# EAGLE design H-Bridge V.2A (EAGLE 7.2.0)
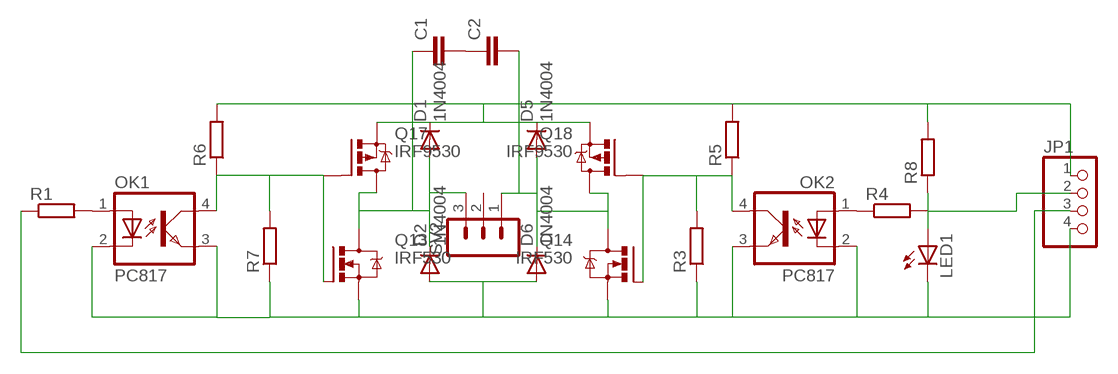
[diagram p0: schematic, sheet 1]

## Parts
C1  C-EU025-025X050  [C025-025X050]
C2  C-EU025-025X050  [C025-025X050]
D1  1N4004  [DO41-10]
D2  1N4004  [DO41-10]
D5  1N4004  [DO41-10]
D6  1N4004  [DO41-10]
JP1  PINHD-1X4  [1X04]
LED1  LED3MM  [LED3MM]
OK1  PC817  [DIL04]
OK2  PC817  [DIL04]
Q13  IRF530  [TO220BV]
Q14  IRF530  [TO220BV]
Q17  IRF9530  [TO220BV]
Q18  IRF9530  [TO220BV]
R1  R-EU_0207/10  [0207/10]
R3  R-EU_0204/7  [0204/7]
R4  R-EU_0207/10  [0207/10]
R5  R-EU_0207/10  [0207/10]
R6  R-EU_0207/10  [0207/10]
R7  R-EU_0204/7  [0204/7]
R8  R-EU_0207/10  [0207/10]
SV2  MA03-1  [MA03-1]

## Nets
+12V: D1.C D5.C JP1.1 Q17.S Q18.S R5.2 R6.2 R8.2
GND: D2.A D6.A JP1.4 LED1.K(C) OK1.2(C) OK1.3(EMIT) OK2.2(C) OK2.3(EMIT) Q13.S Q14.S R3.1 R7.1
N$1: OK2.1(A) R4.1
N$2: OK1.1(A) R1.2
N$3: C1.2 C2.1
N$7: C2.2 D5.A D6.C Q14.D Q18.D SV2.1
N$8: C1.1 D1.A D2.C Q13.D Q17.D SV2.3
N$9: LED1.A R8.1
N$12: OK2.4(COL) Q14.G Q18.G R3.2 R5.1
N$18: OK1.4(COL) Q13.G Q17.G R6.1 R7.2
PWM1: JP1.2 R4.2
PWM2: JP1.3 R1.1
Unconnected: SV2.2

## Library data of the parts
C1 C2 = rcl:C-EU: CAPACITOR, European symbol
D1 D2 D5 D6 = diode:1N4004: DIODE general purpose rectifier, 1 A
JP1 = pinhead:PINHD-1X4: PIN HEADER
LED1 = led:LED: LED OSRAM: - CHIPLED LG R971, LG N971, LY N971, LG Q971, LY Q971, LO R971, LY R971 LH N974, LH R974 LS Q976, LO Q976, LY Q976 LO Q996 - Hyper CHIPLED LW Q18S LB Q993, LB Q99A, LB R99A - SideLED LS A670, LO A670, LY A670, LG A670, LP A670 LB A673, LV A673, LT A673, LW A673 LH A674 LY A675 LS A676, LA A676, LO A676, LY A676, LW A676 LS A679, LY A679, LG A679 - Hyper Micro SIDELED® LS Y876, LA Y876, LO Y876, LY Y876 LT Y87S - SmartLED LW L88C, LW L88S LB L89C, LB L89S, LG L890 LS L89K, LO L89K, LY L89K LS L896, LA L896, LO L896, LY L896 - TOPLED LS T670, LO T670, LY T670, LG T670, LP T670 LSG T670, LSP T670, LSY T670, LOP T670, LYG T670 LG T671, LOG T671, LSG T671 LB T673, LV T673, LT T673, LW T673 LH T674 LS T676, LA T676, LO T676, LY T676, LB T676, LH T676, LSB T676, LW T676 LB T67C, LV T67C, LT T67C, LS T67K, LO T67K, LY T67K, LW E67C LS E67B, LA E67B, LO E67B, LY E67B, LB E67C, LV E67C, LT E67C LW T67C LS T679, LY T679, LG T679 LS T770, LO T770, LY T770, LG T770, LP T770 LB T773, LV T773, LT T773, LW T773 LH T774 LS E675, LA E675, LY E675, LS T675 LS T776, LA T776, LO T776, LY T776, LB T776 LHGB T686 LT T68C, LB T68C - Hyper Mini TOPLED® LB M676 - Mini TOPLED Santana® LG M470 LS M47K, LO M47K, LY M47K Source: http://www.osram.convergy.de LUXEON: - LUMILED® LXK2-PW12-R00, LXK2-PW12-S00, LXK2-PW14-U00, LXK2-PW14-V00 LXK2-PM12-R00, LXK2-PM12-S00, LXK2-PM14-U00 LXK2-PE12-Q00, LXK2-PE12-R00, LXK2-PE12-S00, LXK2-PE14-T00, LXK2-PE14-U00 LXK2-PB12-K00, LXK2-PB12-L00, LXK2-PB12-M00, LXK2-PB14-N00, LXK2-PB14-P00, LXK2-PB14-Q00 LXK2-PR12-L00, LXK2-PR12-M00, LXK2-PR14-Q00, LXK2-PR14-R00 LXK2-PD12-Q00, LXK2-PD12-R00, LXK2-PD12-S00 LXK2-PH12-R00, LXK2-PH12-S00 LXK2-PL12-P00, LXK2-PL12-Q00, LXK2-PL12-R00 Source: www.luxeon.com KINGBRIGHT: KA-3528ASYC Source: www.kingbright.com
OK1 OK2 = optocoupler:PC817: SHARP OPTO COUPLER; MPN: PC817X4J000F; OC_FARNELL: 9707727; OC_NEWARK: 97K7059
Q13 Q14 = transistor-power:IRF530: HEXFET Power MOSFET
Q17 Q18 = transistor-power:IRF9530: P-CHANNEL HEXFET POWER-MOS-FET Source: http://www.irf.com/product-info/datasheets/data/irf9530.pdf
R1 R3-R8 = resistor:R-EU_: RESISTOR, European symbol
SV2 = con-lstb:MA03-1: PIN HEADER

## Board
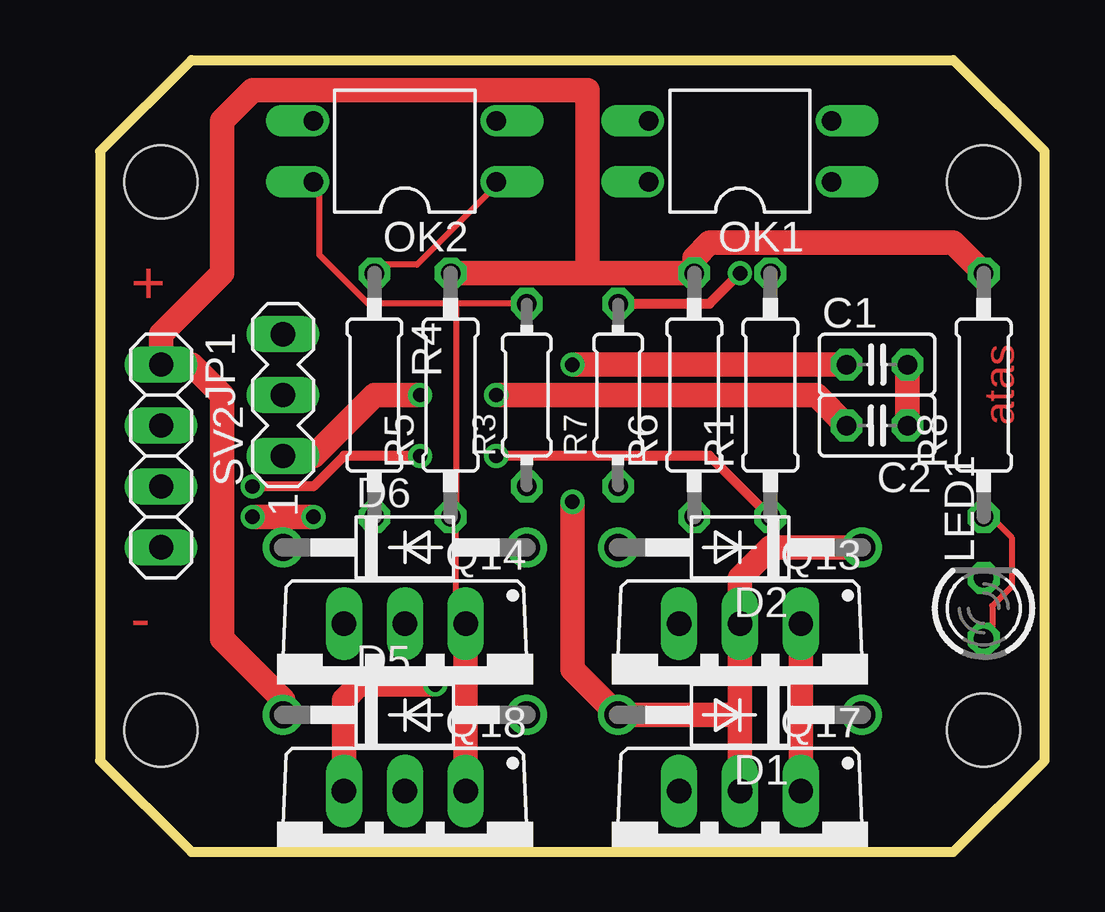
[diagram p1: board, top side]
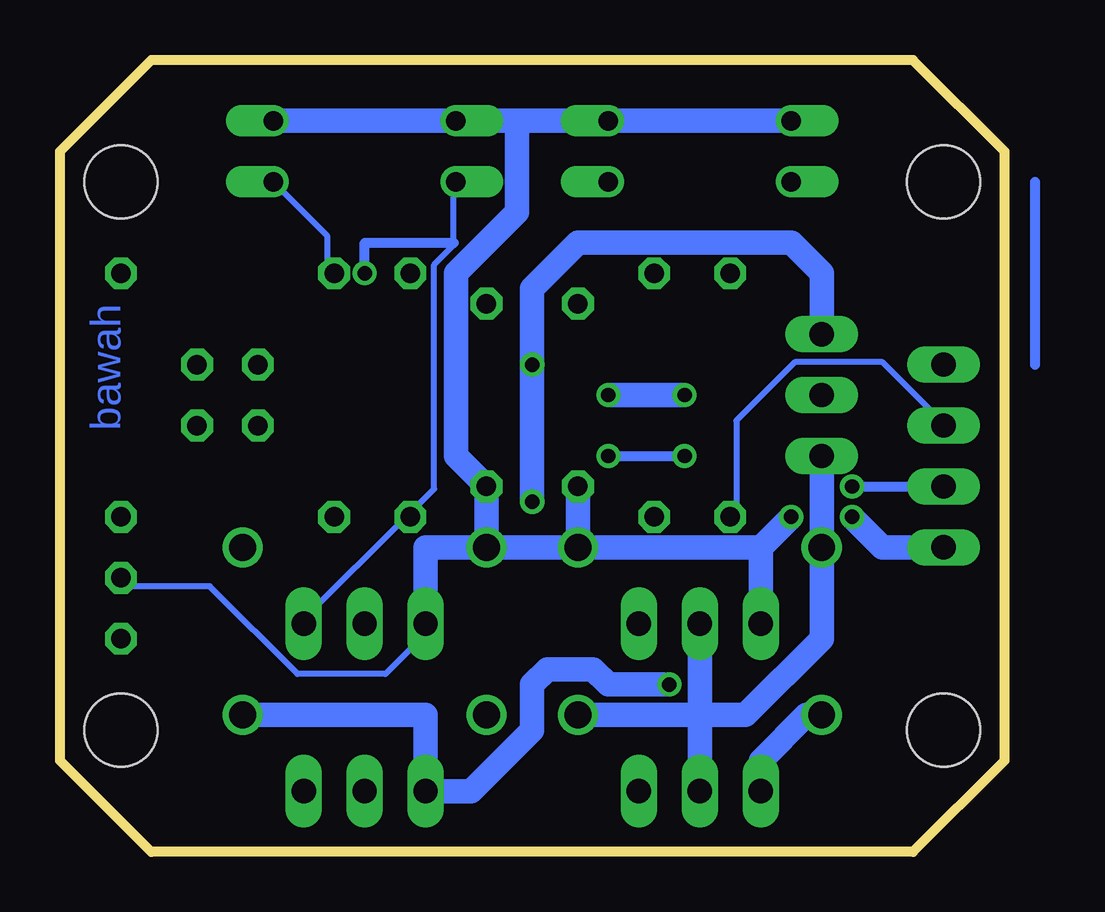
[diagram p2: board, bottom side, seen from below]

Size 39.37 x 33.02 mm. Coordinates in mm from the lower left corner, seen from the top.
Outline: 0,29.21 0,3.81 3.81,0 35.56,0 39.37,3.81 39.37,29.21 35.56,33.02 3.81,33.02 0,29.21
Copper layers (1*16): Top 0.035mm / dielectric 1.5mm / Bottom 0.035mm
Design rules "default": minimum track width 10mil, minimum drill 24mil, track to track 8mil, track to pad 8mil, pad to pad 8mil, via to via 8mil, smd to smd 8mil, copper to edge 40mil, drill to drill 8mil, minimum pad ring 10mil, minimum via ring 8mil, stop-mask expansion 4mil, vias tented up to drill 0mil, thermal gap 10mil
Holes 3.05 mm at 36.83,5.08 36.83,27.94 2.54,27.94 2.54,5.08

### Footprints (pad centres in the part's own frame; a part is rotated, then mirrored left to right if it is on the bottom)
C025-025X050 = drill 0.813 octagon: 1 -1.27,0; 2 1.27,0
DO41-10 = drill 1.118: A 5.08,0; C -5.08,0
1X04 = drill 1.016 long: 1 -3.81,0; 2 -1.27,0; 3 1.27,0; 4 3.81,0
LED3MM = drill 0.813 octagon: A -1.27,0; K 1.27,0
DIL04 = drill 0.813 offset: 1 -1.27,-3.81; 2 1.27,-3.81; 3 1.27,3.81; 4 -1.27,3.81
TO220BV = drill 1.016 long: D 0,-2.54; G -2.54,-2.54; S 2.54,-2.54
0207/10 = drill 0.813 octagon: 1 -5.08,0; 2 5.08,0
0204/7 = drill 0.813 octagon: 1 -3.81,0; 2 3.81,0
MA03-1 = drill 1.016 long: 1 -2.54,0; 2 0,0; 3 2.54,0

### Placement (x,y rotation side)
C1  32.39,20.32 0 top
C2  32.39,17.78 180 top
D1  26.67,5.72 180 top
D2  26.67,12.7 180 top
D5  12.7,5.72 0 top
D6  12.7,12.7 0 top
JP1  2.54,16.51 270 top
LED1  36.83,10.16 90 top
OK1  26.67,29.21 90 top
OK2  12.7,29.21 90 top
Q13  26.67,6.98 180 top
Q14  12.7,6.98 180 top
Q17  26.67,0 180 top
Q18  12.7,0 180 top
R1  27.94,19.05 90 top
R3  17.78,19.05 90 top
R4  11.43,19.05 270 top
R5  14.61,19.05 90 top
R6  24.77,19.05 90 top
R7  21.59,19.05 90 top
R8  36.83,19.05 90 top
SV2  7.62,19.05 90 top

### Tracks (layer width: path | path; a pad name or v marks a point on that pad's centre or on a via)
+12V  (via drill 0.6)
  Top 1.016: v13.97,6.98 10.8,6.98 10.16,6.35 Q18.S | D5.C 7.62,6.35 5.08,8.89 5.08,19.05 3.81,20.32 JP1.1 2.54,21.59 5.08,24.13 5.08,30.48 6.35,31.75 20.32,31.75 20.32,24.13 | R5.2 20.32,24.13 | 20.32,24.13 R6.2 24.77,24.76 25.4,25.4 35.56,25.4 R8.2
  Bottom 1.016: D5.C 8.26,5.72 10.16,3.81 Q18.S | D1.C 24.13,5.72 Q17.S 22.23,2.54 19.69,5.08 19.69,6.98 19.05,7.62 17.15,7.62 16.51,6.98 v13.97,6.98
GND  (via drill 0.6)
  Top 1.016: v6.35,13.97 v8.89,13.97
  Bottom 0.254: LED1.K 36.78,11.07 33.12,11.07 29.46,7.42 25.81,7.42 24.18,9.04 Q13.S
  Bottom 1.016: D6.A 10.16,12.7 | 10.16,12.7 Q14.S | D2.A 24.13,12.7 Q13.S | D6.A D2.A | JP1.4 5.08,12.7 v6.35,13.97 | v8.89,13.97 10.16,12.7 | D2.A R7.1 22.86,16.51 22.86,24.13 20.32,26.67 20.32,30.48 | R3.1 D6.A | OK1.2 OK1.3 20.32,30.48 | OK2.3 OK2.2 20.32,30.48
N$1
  Top 0.254: R4.1 11.58,24.49 13.21,24.49 16.46,27.74 OK2.1
N$2
  Bottom 0.254: OK1.1 28.25,25.7 28.25,24.49 R1.2
N$3
  Top 1.016: C1.2 C2.1
N$4
  Bottom 0.406: -1.27,27.94 -1.27,20.32
N$7  (via drill 0.6)
  Top 1.016: SV2.1 8.89,16.51 11.43,19.05 v13.34,19.05 | v16.51,19.05 29.85,19.05 C2.2
  Bottom 1.016: 12.7,5.72 D5.A | Q14.D 12.7,5.72 | Q18.D 12.7,5.72 | 12.7,5.72 10.8,5.72 7.62,8.89 D6.C SV2.1 | v13.34,19.05 v16.51,19.05
N$8  (via drill 0.6)
  Top 1.016: 26.67,5.72 D1.A 19.69,7.62 v19.69,14.6 | 26.67,5.72 Q13.D 26.67,11.43 27.94,12.7 D2.C | Q17.D 26.67,5.72 | v19.69,20.32 C1.1
  Bottom 1.016: SV2.3 7.62,24.13 8.89,25.4 17.78,25.4 19.69,23.49 v19.69,20.32 v19.69,14.6
N$9
  Top 0.254: LED1.A 37.19,9.04 37.19,10.26 38,11.07 38,13.11 37.19,13.92 R8.1
N$12
  Top 0.254: Q14.G 14.83,9.45 14.83,13.92 R5.1 14.83,14.33 14.83,22.86 | R3.2 14.83,22.86 | 14.83,22.86 11.18,22.86 9.14,24.89 9.14,27.74 OK2.4
  Top 1.016: Q14.G Q18.G
N$18  (via drill 0.6)
  Top 0.254: 21.74,22.86 R7.2 | 24.59,14.33 R6.1
  Top 0.406: 21.74,22.86 25.4,22.86 v26.67,24.13
  Top 1.016: Q13.G Q17.G
  Bottom 0.254: OK1.4 22.96,27.74 22.96,25.4 22.96,25.3 23.77,24.49 23.77,15.14 24.59,14.33 R6.1 24.99,13.92 29.06,9.85 Q13.G
  Bottom 0.406: v26.67,24.13 26.67,25.4 22.96,25.4
PWM1
  Bottom 0.254: R4.2 11.18,14.33 11.18,17.98 8.74,20.42 5.08,20.42 2.64,17.98 JP1.2
PWM2  (via drill 0.6)
  Top 0.406: R1.1 25.4,16.51 v16.51,16.51 | v13.34,16.51 10.16,16.51 8.89,15.24 v6.35,15.24
  Bottom 0.406: v16.51,16.51 v13.34,16.51 | v6.35,15.24 JP1.3

### Text on the board
Top: + | atas | -
Bottom: bawah